# Altium project berry_case_altium.PrjPcb
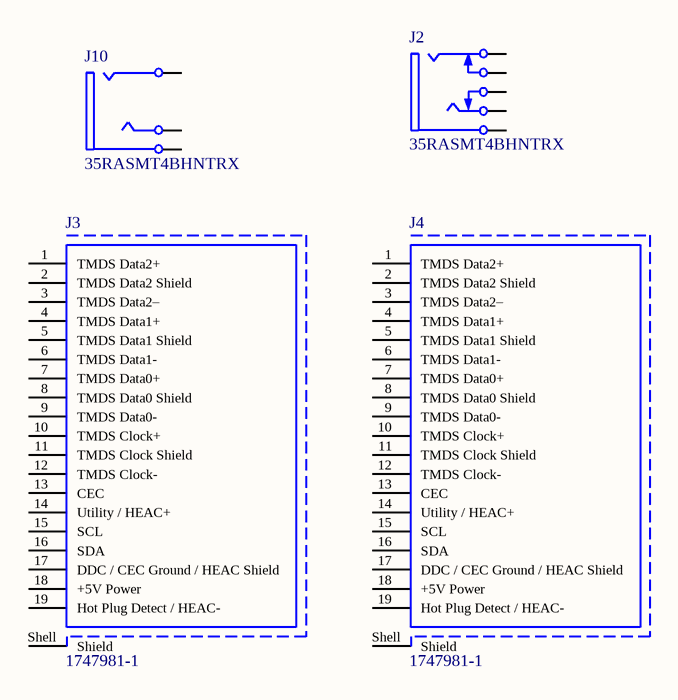
[diagram p0: schematic.SchDoc]
6 sheets, 62 parts. Net scope: hierarchical (ports join the sheet entries above them; power ports are global).
Board files: pcb.PcbDoc, pcb_top.PcbDoc
Sheets:
  schematic.SchDoc
  main.SchDoc
    U_MCU = MCU.SchDoc
    U_power_supply = power_supply.SchDoc
    U_raspberry_interface = raspberry_interface.SchDoc
    U_power_supply_v2 = power_supply_v2.SchDoc

## Sheet schematic.SchDoc
size A4

### Parts
J2  35RASMT4BHNTRX  [AUDIO_FEMALE]
J3  1747981-1  [HDMI_FULL_FEMALE]
J4  1747981-1  [HDMI_FULL_FEMALE]
J10  35RASMT4BHNTRX  [AUDIO_MALE]

### Nets

Not connected (* = marked no-connect by the designer): J2 1 2 3 4 5; J3 1(TMDS_Data2+) 2(TMDS_Data2_Shield) 3(TMDS_Data2–) 4(TMDS_Data1+) 5(TMDS_Data1_Shield) 6(TMDS_Data1-) 7(TMDS_Data0+) 8(TMDS_Data0_Shield) 9(TMDS_Data0-) 10(TMDS_Clock+) 11(TMDS_Clock_Shield) 12(TMDS_Clock-) 13(CEC) 14(Utility_/_HEAC+) 15(SCL) 16(SDA) 17(DDC_/_CEC_Ground_/_HEAC_Shield) 18(+5V_Power) 19(Hot_Plug_Detect_/_HEAC-) Shell(Shield); J4 1(TMDS_Data2+) 2(TMDS_Data2_Shield) 3(TMDS_Data2–) 4(TMDS_Data1+) 5(TMDS_Data1_Shield) 6(TMDS_Data1-) 7(TMDS_Data0+) 8(TMDS_Data0_Shield) 9(TMDS_Data0-) 10(TMDS_Clock+) 11(TMDS_Clock_Shield) 12(TMDS_Clock-) 13(CEC) 14(Utility_/_HEAC+) 15(SCL) 16(SDA) 17(DDC_/_CEC_Ground_/_HEAC_Shield) 18(+5V_Power) 19(Hot_Plug_Detect_/_HEAC-) Shell(Shield); J10 1 2 3

### Library data of the parts
J2 = AUDIO_FEMALE: Female 3.5 mm Phone Jack, 5 Position, Height 5 mm, RoHS, Tape and Reel; Current Rating: 50 mA; Voltage Rating (DC): 12 V; ComponentLink1URL: http://www.switchcraft.com/; ComponentLink2Description: Datasheet; ComponentLink2URL: http://www.switchcraft.com/Drawings/35rasmt4bhntrx_cd.pdf; PackageDescription: Female 3.5 mm Phone Jack, 5 Position, Height 5 mm; PackageReference: 35RASMT4BHNTRX; Mount: Through Hole; DatasheetVersion: Rev. C, 07/2014; Contact Material: Silver; ComponentLink1Description: Manufacturer URL; Packaging: Tape and Reel; RoHSCompliant: true; Contact Plating: Silver; Package Quantity: 3000
J3 J4 = HDMI_FULL_FEMALE: HDMI Receptacle, Pitch 0.5 mm, 19 Position, Height 6.38 mm, RoHS, Tape and Reel; Power Rating: 100 mW; Tolerance: 1%; Resistance: 3.6 kohm; Voltage Rating: 50 V; Packaging: Tape and Reel; Max Operating Temperature: 155degC; RoHSCompliant: True; Case/Package: 0603; Mount: Surface Mount; ComponentLink2URL: http://www.te.com/commerce/DocumentDelivery/DDEController?Action=showdoc&DocId=Customer+Drawing%7F1747981%7FF5%7Fpdf%7FEnglish%7FENG_CD_1747981_F5.pdf%7F1747981-1; Length: 1.6 mm; ComponentLink2Description: Datasheet; ComponentLink1Description: Manufacturer URL; PackageReference: 1747981-1; Package Quantity: 5000; Min Operating Temperature: -55degC; ComponentLink1URL: http://www.te.com/; REACH SVHC: Unknown; Case Code (Imperial): 0603; Height: 0.45 mm; Width: 0.8 mm; DatasheetVersion: Rev. F5, 12/2015; PackageDescription: HDMI Receptacle, Pitch 0.5 mm, 19 Position, Height 6.38 mm; Case Code (Metric): 1608
J10 = AUDIO_MALE: Female 3.5 mm Phone Jack, 5 Position, Height 5 mm, RoHS, Tape and Reel; Current Rating: 50 mA; Voltage Rating (DC): 12 V; ComponentLink1URL: http://www.switchcraft.com/; ComponentLink2Description: Datasheet; ComponentLink2URL: http://www.switchcraft.com/Drawings/35rasmt4bhntrx_cd.pdf; PackageDescription: Female 3.5 mm Phone Jack, 5 Position, Height 5 mm; PackageReference: 35RASMT4BHNTRX; Mount: Through Hole; DatasheetVersion: Rev. C, 07/2014; Contact Material: Silver; ComponentLink1Description: Manufacturer URL; Packaging: Tape and Reel; RoHSCompliant: true; Contact Plating: Silver; Package Quantity: 3000

## Sheet main.SchDoc
size A
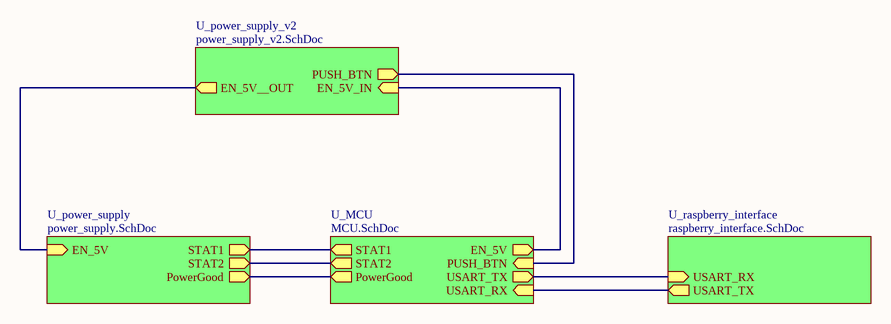
[diagram p1: main.SchDoc]

### Sub-sheets
U_MCU = MCU.SchDoc: STAT2 (out), STAT1 (out), PowerGood (out), EN_5V (out), USART_TX (out), USART_RX (in), PUSH_BTN (in)
U_power_supply = power_supply.SchDoc: STAT1 (out), STAT2 (out), PowerGood (out), EN_5V (in)
U_power_supply_v2 = power_supply_v2.SchDoc: EN_5V_IN (in), EN_5V__OUT (out), PUSH_BTN (out)
U_raspberry_interface = raspberry_interface.SchDoc: USART_TX (out), USART_RX (in)

### Nets
NetC17_2: sheet U_MCU/PUSH_BTN, sheet U_power_supply_v2/PUSH_BTN
NetD2_1: sheet U_MCU/EN_5V, sheet U_power_supply_v2/EN_5V_IN
NetD2_3: sheet U_power_supply/EN_5V, sheet U_power_supply_v2/EN_5V__OUT
NetJ1_8: sheet U_MCU/USART_RX, sheet U_raspberry_interface/USART_TX
NetJ1_10: sheet U_MCU/USART_TX, sheet U_raspberry_interface/USART_RX
NetU2_6: sheet U_MCU/PowerGood, sheet U_power_supply/PowerGood
NetU2_7: sheet U_MCU/STAT2, sheet U_power_supply/STAT2
NetU2_8: sheet U_MCU/STAT1, sheet U_power_supply/STAT1

## Sheet MCU.SchDoc
size A
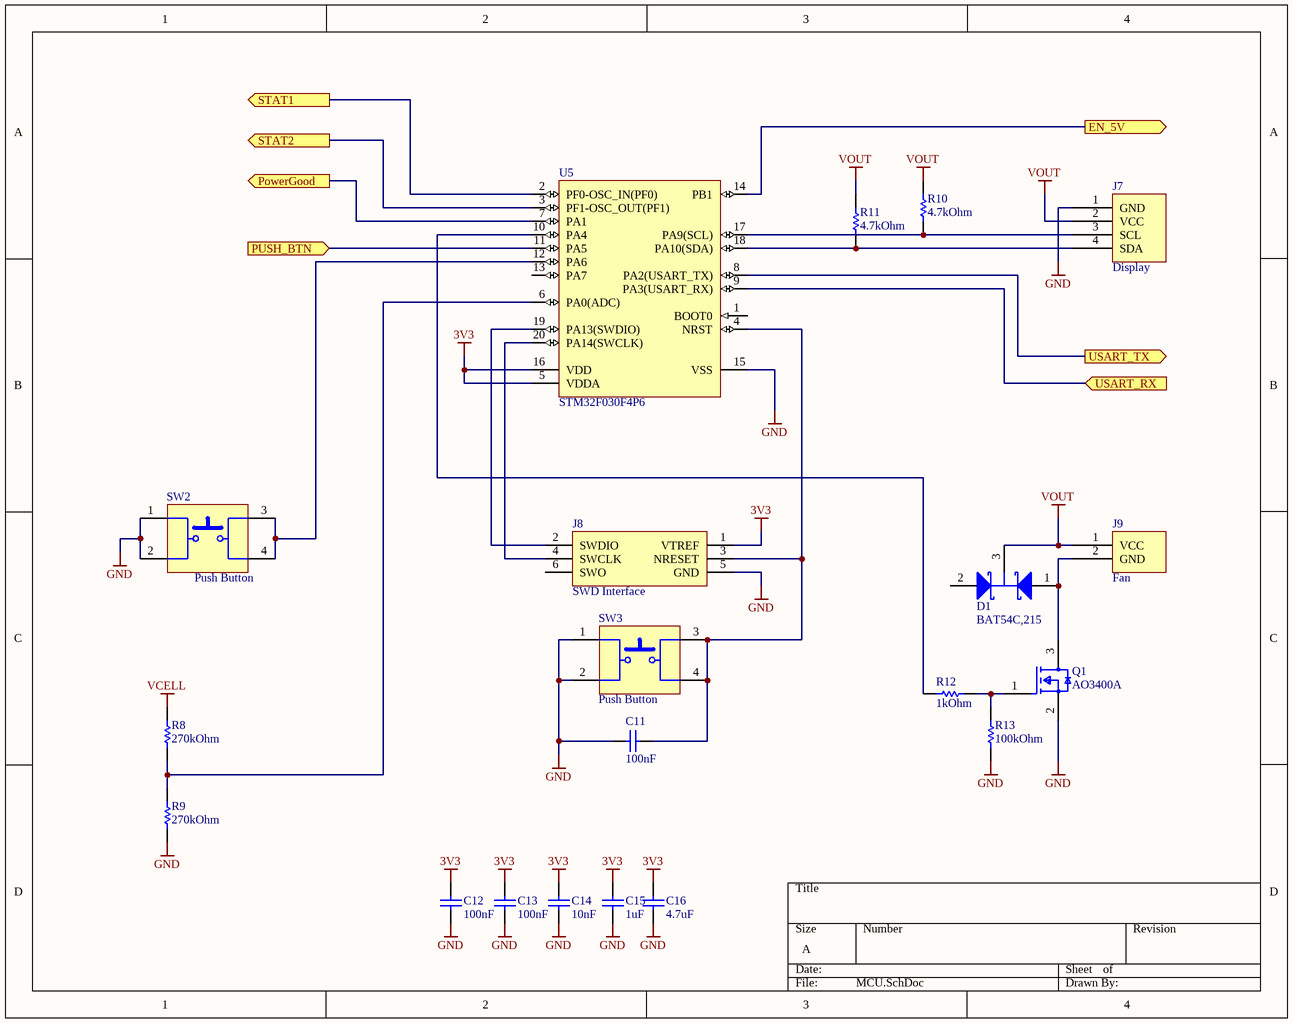
[diagram p2: MCU.SchDoc]

### Parts
C11  100nF  [CAP_0804]
C12  100nF  [CAP_0804]
C13  100nF  [CAP_0804]
C14  10nF  [CAP_0804]
C15  1uF  [CAP_0804]
C16  4.7uF  [CAP_0804]
D1  BAT54C,215  [SOT23]
J7  Display  [OLED_DISPLAY]
J8  SWD Interface  [J-Link_6-pin_Needle_Adapter]  (no BOM)
J9  Fan  [FAN_CONNECTOR]
Q1  AO3400A  [SOT23]
R8  270kOhm  [RES_0804]
R9  270kOhm  [RES_0804]
R10  4.7kOhm  [RES_0804]
R11  4.7kOhm  [RES_0804]
R12  1kOhm  [RES_0804]
R13  100kOhm  [RES_0804]
SW2  Push Button  [SWITCH]
SW3  Push Button  [SWITCH]
U5  STM32F030F4P6  [STM32F030]

### Ports
EN_5V (out), PowerGood (out), PUSH_BTN (in), STAT1 (out), STAT2 (out), USART_RX (in), USART_TX (out)

### Nets
3V3: C12.2 C13.2 C14.2 C15.2 C16.2 J8.1(VTREF) U5.5(VDDA) U5.16(VDD)
GND: C11.1 C12.1 C13.1 C14.1 C15.1 C16.1 J7.1(GND) J8.5(GND) Q1.2(S) R9.1 R13.1 SW2.1 SW2.2 SW3.1 SW3.2 U5.15(VSS)
VCELL: R8.2
VOUT: D1.3(K) J7.2(VCC) J9.1(VCC) R10.2 R11.2
NetC11_2: C11.2 J8.3(NRESET) SW3.3 SW3.4 U5.4(NRST)
NetC17_2: U5.11(PA5) ; port PUSH_BTN
NetD1_1: D1.1(A) J9.2(GND) Q1.3(D)
NetD2_1: U5.14(PB1) ; port EN_5V
NetJ1_8: U5.9(PA3(USART_RX)) ; port USART_RX
NetJ1_10: U5.8(PA2(USART_TX)) ; port USART_TX
NetJ7_3: J7.3(SCL) R10.1 U5.17(PA9(SCL))
NetJ7_4: J7.4(SDA) R11.1 U5.18(PA10(SDA))
NetJ8_2: J8.2(SWDIO) U5.19(PA13(SWDIO))
NetJ8_4: J8.4(SWCLK) U5.20(PA14(SWCLK))
NetQ1_1: Q1.1(G) R12.2 R13.2
NetR8_1: R8.1 R9.2 U5.6(PA0(ADC))
NetR12_1: R12.1 U5.10(PA4)
NetSW2_3: SW2.3 SW2.4 U5.12(PA6)
NetU2_6: U5.7(PA1) ; port PowerGood
NetU2_7: U5.3(PF1-OSC_OUT(PF1)) ; port STAT2
NetU2_8: U5.2(PF0-OSC_IN(PF0)) ; port STAT1

Not connected (* = marked no-connect by the designer): D1 2(A); J8 6(SWO); U5 1(BOOT0) 13(PA7)

### Library data of the parts
C11-C13 = CAP_100NF: PartNumber: 1206GC102KAT1A; Manufacturer: AVX; Capacitance: 0.001uF; Dielectric: X7R; Tolerance: 10%; Tolerance (%): ±10%; Voltage Rating DC: 2000V; Package Reference: 1206; Datasheet Version: 11/2010; Mounting Technology: SurfaceMount; Manufacturer URL: http://www.avx.com/; Datasheet URL: https://datasheet.ciiva.com/11787/0900766b80ed4c37-11787781.pdf; Package Description: 2-Pin SMD, Body 3.4 x 1.8 mm; Case Size/Dimension: 1206; Rated Voltage: 2000V
C14 = CAP_10NF: PartNumber: 1206GC102KAT1A; Manufacturer: AVX; Capacitance: 0.001uF; Dielectric: X7R; Tolerance: 10%; Tolerance (%): ±10%; Voltage Rating DC: 2000V; Package Reference: 1206; Datasheet Version: 11/2010; Mounting Technology: SurfaceMount; Manufacturer URL: http://www.avx.com/; Datasheet URL: https://datasheet.ciiva.com/11787/0900766b80ed4c37-11787781.pdf; Package Description: 2-Pin SMD, Body 3.4 x 1.8 mm; Case Size/Dimension: 1206; Rated Voltage: 2000V
C15 = CAP_1UF: PartNumber: 1206GC102KAT1A; Manufacturer: AVX; Capacitance: 0.001uF; Dielectric: X7R; Tolerance: 10%; Tolerance (%): ±10%; Voltage Rating DC: 2000V; Package Reference: 1206; Datasheet Version: 11/2010; Mounting Technology: SurfaceMount; Manufacturer URL: http://www.avx.com/; Datasheet URL: https://datasheet.ciiva.com/11787/0900766b80ed4c37-11787781.pdf; Package Description: 2-Pin SMD, Body 3.4 x 1.8 mm; Case Size/Dimension: 1206; Rated Voltage: 2000V
C16 = CAP_4.7UF: PartNumber: 1206GC102KAT1A; Manufacturer: AVX; Capacitance: 0.001uF; Dielectric: X7R; Tolerance: 10%; Tolerance (%): ±10%; Voltage Rating DC: 2000V; Package Reference: 1206; Datasheet Version: 11/2010; Mounting Technology: SurfaceMount; Manufacturer URL: http://www.avx.com/; Datasheet URL: https://datasheet.ciiva.com/11787/0900766b80ed4c37-11787781.pdf; Package Description: 2-Pin SMD, Body 3.4 x 1.8 mm; Case Size/Dimension: 1206; Rated Voltage: 2000V
D1 = DIODE_BAT54C: Schottky Barrier Diode, 30 V, 3-Pin SOT23, RoHS, Tape and Reel; Manufacturer: NXP Semiconductors; Forward Surge Current Ifsm Max: 600mA; Pin Configuration: 1A1,2A2,3comK; Package Version: Feb-16; Forward Voltage VF Max: 800mV; SMD Marking: L43/*W1; Diode Case Style: SOT-23; Reverse Recovery Time trr Typ: 5ns; Forward Current If(AV): 200mA; Reel Quantity: 3000; SVHC: NoSVHC(19-Dec-2012); No. of Pins: 3; Junction Temperature Tj Max: 125degC; Common Connection: Cathode; Repetitive Reverse Voltage Vrrm Max: 30V; Operating Temperature Max: 150degC; Operating Temperature Range: -65degCto+150degC; Termination Type: SMD; Package Description: 3-Pin Small Outline Transistor, Body 1.3 x 2.9 mm, Pitch 0.95 mm; Package / Case: SOT-23; Diode Type: Schottky; Manufacturer URL: http://www.nxp.com/; Tape Width: 8mm; Package Reference: SOT23-3; Datasheet URL: https://datasheet.ciiva.com/33723/1668625-33723936.pdf; Datasheet Version: Rev. 5 , 10/2012; Operating Temperature Min: -65degC; Current Ifsm: 600mA; Reverse Recovery Time trr Max: 5ns; Package URL: http://www.nxp.com/documents/outline_drawing/SOT23.pdf; Forward Voltage: 800mV
J7 = Oled Display: Tiger Claw(TM) Socket Strip, Through-hole, Vertical, -55 to 105 degC, 2 mm Pitch, 4-Pin, Female, RoHS; Manufacturer: Samtec; PartNumber: MMS-104-01-T-SV; Pitch: 2 mm; PackageDescription: 2mm Through Hole Box Connector Strip Assembly; DatasheetVersion: F-214; ComponentLink1URL: http://www.samtec.com; RoHS: True; Temperature Range: -55 to 105 degC; ComponentLink1Description: Manufacturer URL; Mounting Technology: Through-hole; ComponentLink2Description: Datasheet; Orientation: Vertical; ComponentLink2URL: http://www.samtec.com/documents/webfiles/pdf/MMS.PDF; ComponentLink3Description: Package Specification; ComponentLink3URL: http://www.samtec.com/documents/webfiles/cpdf/MMS-1XX-01-XXX-XX-XXX-MKT1.pdf; PackageVersion: AO, 2/1993; PackageReference: MMS-104-01-X-SV
J8 = J-Link_6-pin_Needle_Adapter: J-Link 6-pin Needle Adapter
J9 = FAN: Tiger Claw(TM) Socket Strip, Through-hole, Vertical, -55 to 105 degC, 2 mm Pitch, 4-Pin, Female, RoHS; Manufacturer: Samtec; PartNumber: MMS-104-01-T-SV; Pitch: 2 mm; PackageDescription: 2mm Through Hole Box Connector Strip Assembly; DatasheetVersion: F-214; ComponentLink1URL: http://www.samtec.com; RoHS: True; Temperature Range: -55 to 105 degC; ComponentLink1Description: Manufacturer URL; Mounting Technology: Through-hole; ComponentLink2Description: Datasheet; Orientation: Vertical; ComponentLink2URL: http://www.samtec.com/documents/webfiles/pdf/MMS.PDF; ComponentLink3Description: Package Specification; ComponentLink3URL: http://www.samtec.com/documents/webfiles/cpdf/MMS-1XX-01-XXX-XX-XXX-MKT1.pdf; PackageVersion: AO, 2/1993; PackageReference: MMS-104-01-X-SV
Q1 = MOSFET_AO3400A: MOSFET N-CH 30V 5.7A SOT23; Input Capacitance: 630pF; Number of Elements: 1; Rds On Max: 26.5mR; Max Power Dissipation: 1.4W; Gate to Source Voltage (Vgs): 12V; Min Operating Temperature: -55°C; Lead Free: Lead Free; Number of Pins: 3; Drain to Source Voltage (Vdss): 30V; Case/Package: SOT-23; Mount: Surface Mount; Continuous Drain Current (ID): 5.7A; Radiation Hardening: No; Packaging: Tape and Reel; Max Operating Temperature: 150°C; Power Dissipation: 1.4W
R8 R9 = RES_270K: Part Number: CRCW120647K0FKEA; Manufacturer: Vishay Dale
R10 R11 = RES_4.7K: Part Number: CRCW120647K0FKEA; Manufacturer: Vishay Dale
R12 = RES_1K: Part Number: CRCW120647K0FKEA; Manufacturer: Vishay Dale
R13 = RES_100K: Part Number: CRCW120647K0FKEA; Manufacturer: Vishay Dale
SW2 SW3 = SWITCH: Micro Miniature Push Button Switch FSM JSM, 50 mA, -35 to 85 degC, 4-Pin SMD, RoHS, Tape and Reel; Manufacturer: TE Connectivity; Mechanical Life: 100000Cycles; Current Rating: 50mA; Actuator Material: Polyamide; Max Voltage Rating (DC): 12V; Capacitance: 0f; Illumination Type: Illuminated; Voltage Rating (DC): 24V; Case\/Package: SMD/SMT; Operating Force: 160gf; Contact Resistance: 100mOhm; Actuator Length: 0.055inch; Switch Travel: 0.25mm; Throw Configuration: SPST; Termination: GullWing; Contact Plating: Silver; Orientation: Straight; Mounting Technology: SurfaceMount; REACH SVHC: Unknown; Electrical Life: 100000Cycles; Package Reference: FSM4JSMATR; Max Operating Temperature: 85degC; Manufacturer URL: http://www.te.com/; Package Description: 4-Pin Surface Mount Device, Body 6 x 6 mm, Pitch 4.5 mm; Datasheet Version: Rev. V, 02/2015; Packaging: TapeandReel; Min Operating Temperature: -35degC; Mount: SurfaceMount; Contact Current Rating: 50mA; Contact Material: CopperAlloy; Package Quantity: 1200; Datasheet URL: http://www.te.com/commerce/DocumentDelivery/DDEController?Action=showdoc&DocId=Customer+Drawing%7F2-1437565-7%7FV%7Fpdf%7FEnglish%7FENG_CD_2-1437565-7_V.pdf%7F4-1437565-2; RoHSCompliant: true
U5 = STM32F030: ARM Cortex-M0 32-bit MCU, 16 KB Flash, 4 KB Internal RAM, 15 I/Os, 20-pin TSSOP, -40 to 85 degC, Tube; I/Os (High Current): 15; FLASH Size (Prog) (kB): 16; Internal RAM Size (kB): 4; Supply Voltage(Vcc) min (V): 2.4; Operating Frequency(F) (Processor speed) (MHz): 48; ComponentLink2URL: http://www.st.com/st-web-ui/static/active/en/resource/technical/document/datasheet/DM00088500.pdf; Core: ARM Cortex-M0; ComponentLink2Description: Datasheet; PackageDescription: 20-Pin Thin Shrink Small Outline Package, 6.5 x 4.4 mm Body, 0.65 mm Pitch; Mounting Technology: Surface Mount; ComponentLink1URL: http://www.st.com/web/en/home.html; PackageVersion: Rev. 1, 11/2012; ComponentLink3Description: Package Specification; PartNumber: STM32F030F4P6; ComponentLink3URL: http://www.st.com/st-web-ui/static/active/en/resource/technical/document/datasheet/DM00065136.pdf; DatasheetVersion: Rev. 1; PackageReference: TSSOP20; ComponentLink1Description: Manufacturer URL; Packing: Tube

## Sheet power_supply.SchDoc
size A
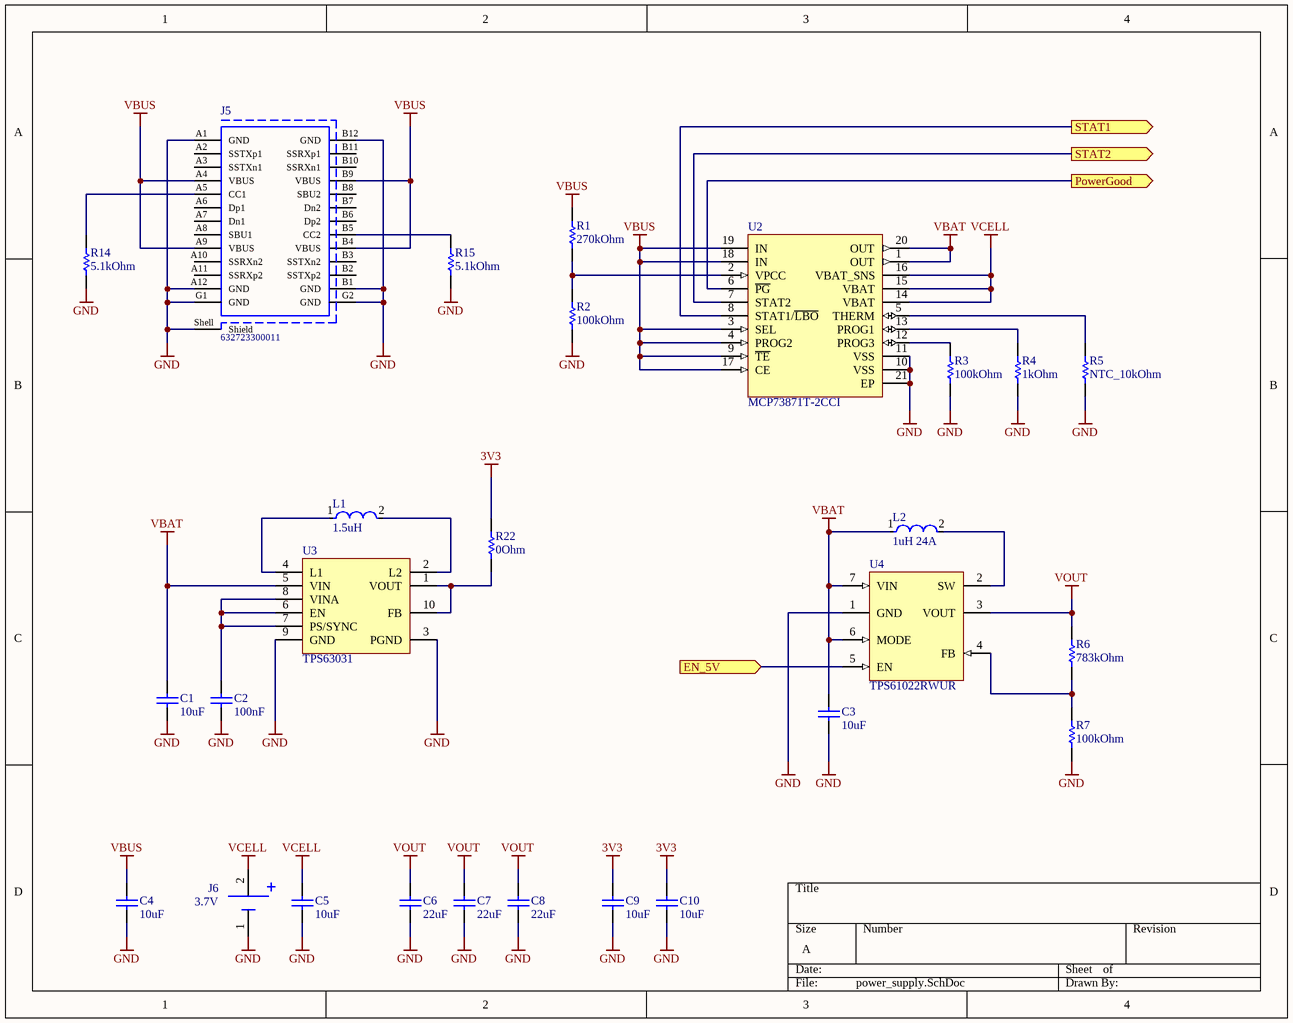
[diagram p3: power_supply.SchDoc]

### Parts
C1  10uF  [CAP_0804]
C2  100nF  [CAP_0804]
C3  10uF  [CAP_0804]
C4  10uF  [CAP_0804]
C5  10uF  [CAP_0804]
C6  22uF  [CAP_0804]
C7  22uF  [CAP_0804]
C8  22uF  [CAP_0804]
C9  10uF  [CAP_0804]
C10  10uF  [CAP_0804]
J5  632723300011  [USB_C_FEMALE]
J6  3.7V  [BATTERY - duplicate]
L1  1.5uH  [INDUCTOR_1.5UH]
L2  1uH 24A  [INDUCTOR_1UH]
R1  270kOhm  [RES_0804]
R2  100kOhm  [RES_0804]
R3  100kOhm  [RES_0804]
R4  1kOhm  [RES_0804]
R5  NTC_10kOhm  [RES_0804]
R6  783kOhm  [RES_0804]
R7  100kOhm  [RES_0804]
R14  5.1kOhm  [RES_0804]
R15  5.1kOhm  [RES_0804]
R22  0Ohm  [RES_0804]
U2  MCP73871T-2CCI  [MCP73871T-2CCI]
U3  TPS63031  [TPS63031]
U4  TPS61022RWUR  [TPS61022]

### Ports
EN_5V (in), PowerGood (out), STAT1 (out), STAT2 (out)

### Nets
3V3: C9.2 C10.2 R22.2
GND: C1.1 C2.1 C3.1 C4.1 C5.1 C6.1 C7.1 C8.1 C9.1 C10.1 J5.A1(GND) J5.A12(GND) J5.B1(GND) J5.B12(GND) J5.G1(GND) J5.G2(GND) J5.Shell(Shield) J6.1 R2.1 R3.1 R4.1 R5.1 R7.1 R14.1 R15.1 U2.10(VSS) U2.11(VSS) U2.21(EP) U3.3(PGND) U3.9(GND) U4.1(GND)
VBAT: C1.2 C3.2 L2.1 U2.1(OUT) U2.20(OUT) U3.5(VIN) U4.6(MODE) U4.7(VIN)
VBUS: C4.2 J5.A4(VBUS) J5.A9(VBUS) J5.B4(VBUS) J5.B9(VBUS) R1.2 U2.3(SEL) U2.4(PROG2) U2.9(~{TE}) U2.17(CE) U2.18(IN) U2.19(IN)
VCELL: C5.2 J6.2 U2.14(VBAT) U2.15(VBAT) U2.16(VBAT_SNS)
VOUT: C6.2 C7.2 C8.2 R6.2 U4.3(VOUT)
NetC2_2: C2.2 U3.6(EN) U3.7(PS/SYNC) U3.8(VINA)
NetD2_3: U4.5(EN) ; port EN_5V
NetJ5_A5: J5.A5(CC1) R14.2
NetJ5_B5: J5.B5(CC2) R15.2
NetL1_1: L1.1 U3.4(L1)
NetL1_2: L1.2 U3.2(L2)
NetL2_2: L2.2 U4.2(SW)
NetR1_1: R1.1 R2.2 U2.2(VPCC)
NetR3_2: R3.2 U2.12(PROG3)
NetR4_2: R4.2 U2.13(PROG1)
NetR5_2: R5.2 U2.5(THERM)
NetR6_1: R6.1 R7.2 U4.4(FB)
NetR22_1: R22.1 U3.1(VOUT) U3.10(FB)
NetU2_6: U2.6(~{PG}) ; port PowerGood
NetU2_7: U2.7(STAT2) ; port STAT2
NetU2_8: U2.8(STAT1/~{LBO}) ; port STAT1

Not connected (* = marked no-connect by the designer): J5 A2(SSTXp1) A3(SSTXn1) A6(Dp1) A7(Dn1) A8(SBU1) A10(SSRXn2) A11(SSRXp2) B2(SSTXp2) B3(SSTXn2) B6(Dp2) B7(Dn2) B8(SBU2) B10(SSRXn1) B11(SSRXp1)

### Library data of the parts
C1 C3-C5 C9 C10 = CAP_10UF: PartNumber: 1206GC102KAT1A; Manufacturer: AVX; Capacitance: 0.001uF; Dielectric: X7R; Tolerance: 10%; Tolerance (%): ±10%; Voltage Rating DC: 2000V; Package Reference: 1206; Datasheet Version: 11/2010; Mounting Technology: SurfaceMount; Manufacturer URL: http://www.avx.com/; Datasheet URL: https://datasheet.ciiva.com/11787/0900766b80ed4c37-11787781.pdf; Package Description: 2-Pin SMD, Body 3.4 x 1.8 mm; Case Size/Dimension: 1206; Rated Voltage: 2000V
C2 = CAP_100NF: as C11 on sheet MCU; Package Reference: 1206; Datasheet Version: 11/2010; Mounting Technology: SurfaceMount; Manufacturer URL: http://www.avx.com/; Datasheet URL: https://datasheet.ciiva.com/11787/0900766b80ed4c37-11787781.pdf; Package Description: 2-Pin SMD, Body 3.4 x 1.8 mm; Case Size/Dimension: 1206; Rated Voltage: 2000V
C6-C8 = CAP_22UF: PartNumber: 1206GC102KAT1A; Manufacturer: AVX; Capacitance: 0.001uF; Dielectric: X7R; Tolerance: 10%; Tolerance (%): ±10%; Voltage Rating DC: 2000V; Package Reference: 1206; Datasheet Version: 11/2010; Mounting Technology: SurfaceMount; Manufacturer URL: http://www.avx.com/; Datasheet URL: https://datasheet.ciiva.com/11787/0900766b80ed4c37-11787781.pdf; Package Description: 2-Pin SMD, Body 3.4 x 1.8 mm; Case Size/Dimension: 1206; Rated Voltage: 2000V
J5 = USB_C_FEMALE: USB 3.1 Type C Receptacle WR-COM, Horizontal, SMT / THT; Manufacturer: Wurth Elektronik; Rated Current: 5A; Contact Resistance: 30mOhm; Working Voltage: 20VDC; Operating Temperature: -40to105degC; Package Reference: 632723300011; Datasheet URL: https://katalog.we-online.de/em/datasheet/632723x00011%282%29.pdf; Manufacturer URL: http://www.we-online.de; Connector Type: USB3.1TypeC; Gender: Receptacle; Part Number: 632723300011; Mounting Technology: SMT/THT; Publisher: WurthElektronik; Packaging: TapeandReel; Orientation: Horizontal
J6 = BATTERY: CONN HEADER VERT 2POS 1.25MM; Manufacturer Part Number: 53047-0210; Manufacturer: Molex; Conn Gender: Male; Voltage Rating: 125V; Conn Orientation: Vertical; Number Of Contacts: 2; Current Rating: 1A; Description: CONNECTOR, HEADER, 2POS, 1ROW, 1.25MM; Contact Material: Tin; Temperature Range Low: -40°C; ComponentLink2URL: http://www.molex.com/webdocs/datasheets/pdf/en-us/0530470210_PCB_HEADERS.pdf; Mouser Description: 1.25mm Pitch PicoBlade™ Wire-to-Board Header, Vertical, with Friction Lock, 2 Circuits; Temperature Range High: +85°C; ComponentLink2Description: Datasheet; Automotive: No; RoHS: TRUE; Ambient Temperature Range High: +85°C; Octopart: https://octopart.com/53047-0210-molex-276772; Footprint Url: https://www.molex.com/pdm_docs/sd/530470210_sd.pdf; Lead Free: Yes; Pitch: 1.25mm; Temperature: -40°C to +85°C; Device Class L2: Headers and Wire Housings; Package: 0; Ambient Temperature Range Low: -40°C; Digikey Description: CONN HEADER VERT 2POS 1.25MM; Category: Conn; Device Class L3: unset; Number Of Rows: 1; Device Class L1: Connectors; Height: 4.4mm
L1 = INDUCTOR_1.5UH: FIXED IND 1.5UH 7A 4.3 MOHM SMD; Manufacturer: bourns; Manufacturer Part Number: SRU1048-1R5Y; Shielding: true; Saturation Current: 7.2A; Self Resonant Frequency: 70MHz; Q Factor: 14; Test Frequency: 100kHz; Tolerance: 30%; Core Material: Ferrite; Mouser Description: Inductor Power Shielded Wirewound 1.5uH 30% 100KHz 14Q-Factor Ferrite 7A 0.0043Ohm DCR T/R; Height: 5.1mm; Digikey Description: FIXED IND 1.5UH 7A 4.3 MOHM SMD; Rms Current: 7A; Automotive: No; Package: SRU1048; Device Class L1: Passive Components; ComponentLink2Description: Datasheet; Category: Ind; Device Class L2: Inductors; Octopart: https://octopart.com/sru1048-1r5y-bourns-1020385; Temperature Range Low: -40°C; Composition: Wirewound; ComponentLink2URL: https://www.bourns.com/docs/Product-Datasheets/SRU1048.pdf; Inductance: 1.5uH; RoHS: TRUE; Lead Free: Yes; Device Class L3: Fixed Inductors; Temperature: -40°C to +125°C; Value: 1.5uH; Temperature Range High: +125°C
L2 = INDUCTOR_1UH: FIXED IND 1UH 24A 3.5 MOHM SMD; Manufacturer Part Number: SRP1238A-1R0M; Manufacturer: Bourns; Q Factor: 15; Self Resonant Frequency: 40MHz; Series Resistance: 3.5mΩ; Automotive Grade: Grade 0; Shielding: true; Tolerance: 20%; Saturation Current: 40A; Test Frequency: 100kHz; Core Material: Carbonyl Powder; Digikey Description: FIXED IND 1UH 24A 3.5 MOHM SMD; Device Class L1: Passive Components; Device Class L3: Fixed Inductors; Value: 1uH; Rms Current: 24A; Mouser Description: Inductor Power Shielded Wirewound 1uH 20% 100KHz 15Q-Factor Carbonyl Powder 24A 3.5mOhm DCR Automotive T/R; Automotive: Yes; Octopart: https://octopart.com/srp1238a-1r0m-bourns-47099079; Temperature Range Low: -55°C; Category: Ind; Package: SRP1238A; Device Class L2: Inductors; ComponentLink2URL: https://www.bourns.com/docs/product-datasheets/srp1238a.pdf?sfvrsn=2a7391f1_31; Temperature Range High: +150°C; ComponentLink2Description: Datasheet; Composition: Wirewound; Height: 3.5mm; Lead Free: Yes; Temperature: -55°C to +150°C; RoHS: TRUE; Inductance: 1uH
R1 = RES_270K: as R8 on sheet MCU
R2 R3 R7 = RES_100K: as R13 on sheet MCU
R4 = RES_1K: as R12 on sheet MCU
R5 = NTC_10K: Manufacturer: Vishay Dale; Part Number: NTHS1206N02N1002JE
R6 = RES_783K: Part Number: CRCW120647K0FKEA; Manufacturer: Vishay Dale
R14 R15 = RES_5.1K: Part Number: CRCW120647K0FKEA; Manufacturer: Vishay Dale
R22 = RES_0R: Part Number: CRCW120647K0FKEA; Manufacturer: Vishay Dale
U2 = MCP73871T-2CCI: Stand-Alone System Load Sharing and Li-Ion/Li-Polymer Battery Charge Management Controller, 4.4V, 20-Pin QFN, Industrial Temperature, Tape and Reel; DatasheetVersion: revB, May-2009; PackageReference: QFN-ML20; PackageDescription: 20-Lead Plastic Quad Flat, No Lead Package (ML) - 4x4x0.9 mm Body [QFN]; PackageVersion: revBB, Aug-2009
U3 = TPS63031: 3V3 BUCK BOOST TEXAS INSTRUMENTS - TPS63031DSKT - IC, DC DC CONV, 1A, 10SON, FULL REEL; Synchronous Rectifier: Yes; Output Voltage: 3.3V; Output Current: 800mA; Min Input Voltage: 1.8V; Max Input Voltage: 5.5V; Number of Outputs: 1; Switching Frequency: 2.4MHz; Output Type: Fixed; Quiescent Current: 25uA; Min Output Voltage: 3.267V; Efficiency: 96%; Topology: Buck-Boost; Supplier 1: Digi-Key; Manufacturer: Texas Instruments; Manufacturer Part Number: TPS63031DSKT; RoHS: Yes; Category: Voltage Regulators - Switching; Stock 1: 9581; Pricing 1: 1=2.15000, 10=1.93200, 25=1.82240, 100=1.45800 (USD); Mount: Surface Mount; Number of Pins: 10; Contact Plating: Gold; Min Operating Temperature: -40°C; Max Operating Temperature: 85°C; Packaging: Tape and Reel; Package Quantity: 1; Max Output Current: 800mA; Max Output Voltage: 3.3V; Nominal Output Voltage: 3.3V; Termination: SMD/SMT; Frequency: 2.4MHz; Max Supply Voltage: 5.5V; Min Supply Voltage: 1.8V; Length: 2.5mm; Height: 0.75mm; Width: 2.5mm; Radiation Hardening: No; Lead Free: Lead Free; REACH SVHC: No SVHC; ComponentLink1URL: https://datasheet.ciiva.com/2026/tps63031-2026128.pdf?src-supplier=Digi-Key; ComponentLink1Description: https://datasheet.ciiva.com/2026/tps63031-2026128.pdf?src-supplier=Digi-Key; ComponentLink2URL: https://datasheet.ciiva.com/4879/slvs696b-120507-4879760.pdf?src-supplier=Mouser; ComponentLink2Description: https://datasheet.ciiva.com/4879/slvs696b-120507-4879760.pdf?src-supplier=Mouser; ComponentLink3URL: https://datasheet.ciiva.com/22755/1781625-22755970.pdf?src-supplier=Farnell; ComponentLink3Description: https://datasheet.ciiva.com/22755/1781625-22755970.pdf?src-supplier=Farnell; ComponentLink4URL: https://datasheet.ciiva.com/15113/getdatasheetpartid-196765-15113811.pdf?src-supplier=Verical; ComponentLink4Description: https://datasheet.ciiva.com/15113/getdatasheetpartid-196765-15113811.pdf?src-supplier=Verical; ComponentLink5URL: https://datasheet.ciiva.com/41462/001014941-da-01-en-ic-reg-buck-bst-tps63031dskt-wson-10-tid-41462787.pdf?src-supplier=Conrad; ComponentLink5Description: https://datasheet.ciiva.com/41462/001014941-da-01-en-ic-reg-buck-bst-tps63031dskt-wson-10-tid-41462787.pdf?src-supplier=Conrad; ComponentLink6URL: https://datasheet.ciiva.com/7994/1856306-7994054.pdf?src-supplier=Element14; ComponentLink6Description: https://datasheet.ciiva.com/7994/1856306-7994054.pdf?src-supplier=Element14; ComponentLink7URL: https://datasheet.ciiva.com/3221/tps63030-3221514.pdf?src-supplier=Avnet; ComponentLink7Description: https://datasheet.ciiva.com/3221/tps63030-3221514.pdf?src-supplier=Avnet; ComponentLink8URL: https://datasheet.ciiva.com/26098/tps63030-26098574.pdf?src-supplier=Avnet+Europe; ComponentLink8Description: https://datasheet.ciiva.com/26098/tps63030-26098574.pdf?src-supplier=Avnet+Europe; Supplier Part Number 1: 296-23904-1-ND; Description: TEXAS INSTRUMENTS - TPS63031DSKT - IC, DC DC CONV, 1A, 10SON, FULL REEL
U4 = TPS61022: 5V BOOST; Manufacturer: Texas Instruments; Output Type: AdjustableProgrammable; Min Supply Voltage: 0.5V; Nominal Supply Current: 27uA; Standoff Height: 0mm; Max Junction Temp: +125°C; Output Current: 8A; Output Voltage: 2.2-5.5V; Max Supply Voltage: 5.5V; Switching Frequency: 600-1000kHz; Max Duty Cycle: 97%; Number Of Outputs: 1; Description: Switching Regulator IC     Output; Height: 1mm; Temperature Range High: +125°C; ComponentLink2Description: Datasheet; RoHS: TRUE; Octopart: https://octopart.com/tps61022rwur-texas+instruments-100045592; Switching Topology: Boost; Digikey Description: POWER MANAGEMENT; Lead Free: Yes; Manufacturer Part Number: TPS61022RWUR; Device Class L3: Voltage Regulators - Switching; Automotive: No; Device Class L1: Integrated Circuits (ICs); Package: RWU0007A; Category: IC; Temperature Range Low: -40°C; Mouser Description: 8-A boost converter with 0.5-V ultra-low input voltage 7-VQFN-HR -40 to 125; ComponentLink2URL: http://www.ti.com/lit/ds/symlink/tps61022.pdf; Temperature: -40°C to +125°C; Device Class L2: Power Management ICs

## Sheet raspberry_interface.SchDoc
size A
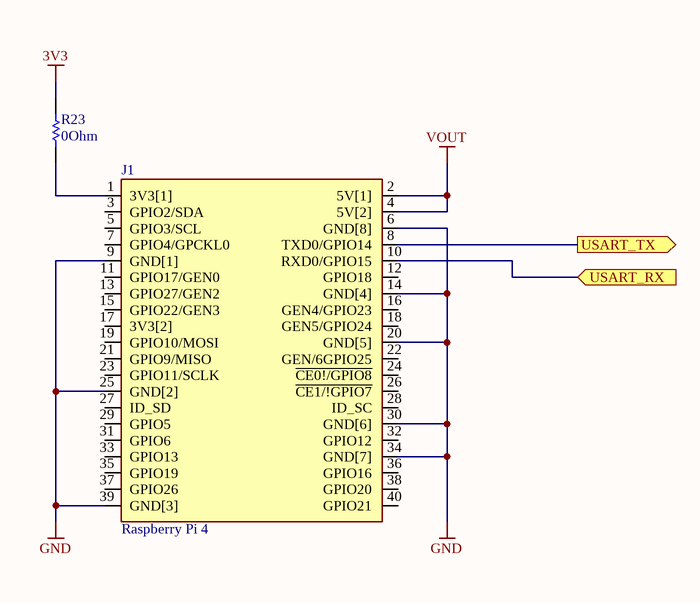
[diagram p4: raspberry_interface.SchDoc]

### Parts
J1  Raspberry Pi 4  [40P_HEADER]
R23  0Ohm  [RES_0804]

### Ports
USART_RX (in), USART_TX (out)

### Nets
3V3: R23.2
GND: J1.6(GND[8]) J1.9(GND[1]) J1.14(GND[4]) J1.20(GND[5]) J1.25(GND[2]) J1.30(GND[6]) J1.34(GND[7]) J1.39(GND[3])
VOUT: J1.2(5V[1]) J1.4(5V[2])
NetJ1_1: J1.1(3V3[1]) R23.1
NetJ1_8: J1.8(TXD0/GPIO14) ; port USART_TX
NetJ1_10: J1.10(RXD0/GPIO15) ; port USART_RX

Not connected (* = marked no-connect by the designer): J1 3(GPIO2/SDA) 5(GPIO3/SCL) 7(GPIO4/GPCKL0) 11(GPIO17/GEN0) 12(GPIO18) 13(GPIO27/GEN2) 15(GPIO22/GEN3) 16(GEN4/GPIO23) 17(3V3[2]) 18(GEN5/GPIO24) 19(GPIO10/MOSI) 21(GPIO9/MISO) 22(GEN/6GPIO25) 23(GPIO11/SCLK) 24(~{CE0!/GPIO8}) 26(~{CE1/!GPIO7}) 27(ID_SD) 28(ID_SC) 29(GPIO5) 31(GPIO6) 32(GPIO12) 33(GPIO13) 35(GPIO19) 36(GPIO16) 37(GPIO26) 38(GPIO20) 40(GPIO21)

### Library data of the parts
J1 = RASPBERRY_PI4: Raspberry Pi 4 with Headers_; MP: ADA3708; Availability: Unavailable; Package: None; MF: Raspberry Pi; Value: *; Price: None; SnapEDA_Link: https://www.snapeda.com/parts/ADA3708/Raspberry%20Pi/view-part/2770118/?ref=snap
R23 = RES_0R: as R22 on sheet power_supply

## Sheet power_supply_v2.SchDoc
size A
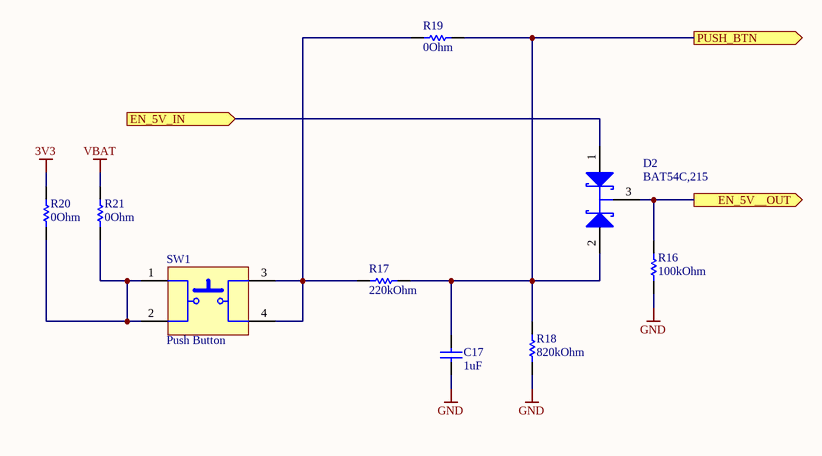
[diagram p5: power_supply_v2.SchDoc]

### Parts
C17  1uF  [CAP_0804]
D2  BAT54C,215  [SOT23]
R16  100kOhm  [RES_0804]
R17  220kOhm  [RES_0804]
R18  820kOhm  [RES_0804]
R19  0Ohm  [RES_0804]
R20  0Ohm  [RES_0804]
R21  0Ohm  [RES_0804]
SW1  Push Button  [SWITCH]

### Ports
EN_5V__OUT (out), EN_5V_IN (in), PUSH_BTN (out)

### Nets
3V3: R20.2
GND: C17.1 R16.1 R18.1
VBAT: R21.2
NetC17_2: C17.2 D2.2(A) R17.2 R18.2 R19.2 ; port PUSH_BTN
NetD2_1: D2.1(A) ; port EN_5V_IN
NetD2_3: D2.3(K) R16.2 ; port EN_5V__OUT
NetR17_1: R17.1 R19.1 SW1.3 SW1.4
NetR20_1: R20.1 R21.1 SW1.1 SW1.2

### Library data of the parts
C17 = CAP_1UF: as C15 on sheet MCU; Package Reference: 1206; Datasheet Version: 11/2010; Mounting Technology: SurfaceMount; Manufacturer URL: http://www.avx.com/; Datasheet URL: https://datasheet.ciiva.com/11787/0900766b80ed4c37-11787781.pdf; Package Description: 2-Pin SMD, Body 3.4 x 1.8 mm; Case Size/Dimension: 1206; Rated Voltage: 2000V
D2 = DIODE_BAT54C: as D1 on sheet MCU; Operating Temperature Max: 150degC; Operating Temperature Range: -65degCto+150degC; Termination Type: SMD; Package Description: 3-Pin Small Outline Transistor, Body 1.3 x 2.9 mm, Pitch 0.95 mm; Package / Case: SOT-23; Diode Type: Schottky; Manufacturer URL: http://www.nxp.com/; Tape Width: 8mm; Package Reference: SOT23-3; Datasheet URL: https://datasheet.ciiva.com/33723/1668625-33723936.pdf; Datasheet Version: Rev. 5 , 10/2012; Operating Temperature Min: -65degC; Current Ifsm: 600mA; Reverse Recovery Time trr Max: 5ns; Package URL: http://www.nxp.com/documents/outline_drawing/SOT23.pdf; Forward Voltage: 800mV
R16 = RES_100K: as R13 on sheet MCU
R17 = RES_220K: Part Number: CRCW120647K0FKEA; Manufacturer: Vishay Dale
R18 = RES_820K: Part Number: CRCW120647K0FKEA; Manufacturer: Vishay Dale
R19-R21 = RES_0R: as R22 on sheet power_supply
SW1 = SWITCH: as SW2 on sheet MCU; Termination: GullWing; Contact Plating: Silver; Orientation: Straight; Mounting Technology: SurfaceMount; REACH SVHC: Unknown; Electrical Life: 100000Cycles; Package Reference: FSM4JSMATR; Max Operating Temperature: 85degC; Manufacturer URL: http://www.te.com/; Package Description: 4-Pin Surface Mount Device, Body 6 x 6 mm, Pitch 4.5 mm; Datasheet Version: Rev. V, 02/2015; Packaging: TapeandReel; Min Operating Temperature: -35degC; Mount: SurfaceMount; Contact Current Rating: 50mA; Contact Material: CopperAlloy; Package Quantity: 1200; Datasheet URL: http://www.te.com/commerce/DocumentDelivery/DDEController?Action=showdoc&DocId=Customer+Drawing%7F2-1437565-7%7FV%7Fpdf%7FEnglish%7FENG_CD_2-1437565-7_V.pdf%7F4-1437565-2; RoHSCompliant: true

## Nets that join several sheets
3V3: MCU (8 pins), power_supply (C9.2 C10.2 R22.2), raspberry_interface (R23.2), power_supply_v2 (R20.2)
GND: MCU (16 pins), power_supply (31 pins), raspberry_interface (8 pins), power_supply_v2 (C17.1 R16.1 R18.1)
VBAT: power_supply (8 pins), power_supply_v2 (R21.2)
VCELL: MCU (R8.2), power_supply (5 pins)
VOUT: MCU (5 pins), power_supply (5 pins), raspberry_interface (J1.2 J1.4)
NetC17_2: MCU (U5.11), power_supply_v2 (5 pins)
NetD2_1: MCU (U5.14), power_supply_v2 (D2.1)
NetD2_3: power_supply (U4.5), power_supply_v2 (D2.3 R16.2)
NetJ1_8: MCU (U5.9), raspberry_interface (J1.8)
NetJ1_10: MCU (U5.8), raspberry_interface (J1.10)
NetU2_6: MCU (U5.7), power_supply (U2.6)
NetU2_7: MCU (U5.3), power_supply (U2.7)
NetU2_8: MCU (U5.2), power_supply (U2.8)